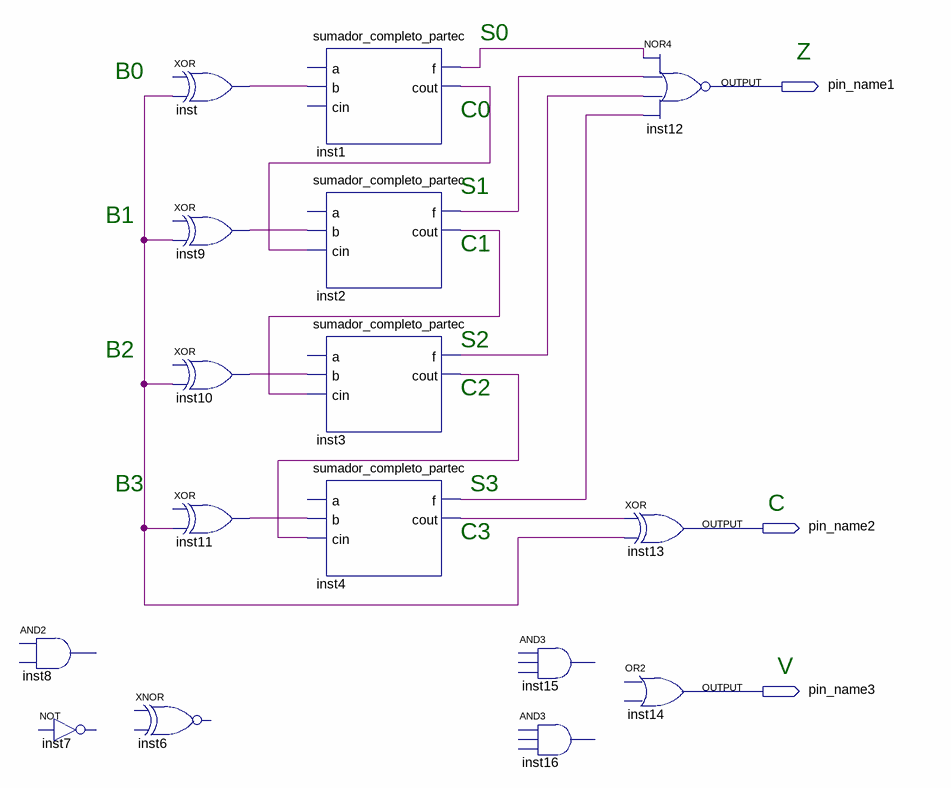
[diagram p0: schematic sheet]
// Quartus schematic sumador_completo_partec.bdf as structural Verilog: 16 symbols, 3 pins
module sumador_completo_partec (
  output pin_name1,
  output pin_name2,
  output pin_name3
);

  wire inst1_cout, inst1_f, inst2_cout, inst2_f, inst3_cout, inst3_f, inst4_cout, inst4_f, inst9_out,
       inst10_out, inst11_out, inst_out, undriven;

  // AND2 inst8 is placed but not wired
  // NOT inst7 is placed but not wired
  buf inst (inst_out, undriven);  // XOR open: IN1
  buf inst9 (inst9_out, undriven);  // XOR open: IN1
  buf inst10 (inst10_out, undriven);  // XOR open: IN1
  buf inst11 (inst11_out, undriven);  // XOR open: IN1
  // XNOR inst6 is placed but not wired
  sumador_completo_partec inst1 (.b(inst_out), .f(inst1_f), .cout(inst1_cout));  // open: a, cin
  sumador_completo_partec inst2 (.b(inst9_out), .cin(inst1_cout), .f(inst2_f), .cout(inst2_cout));  // open: a
  sumador_completo_partec inst3 (.b(inst10_out), .cin(inst2_cout), .f(inst3_f), .cout(inst3_cout));  // open: a
  sumador_completo_partec inst4 (.b(inst11_out), .cin(inst3_cout), .f(inst4_f), .cout(inst4_cout));  // open: a
  // AND3 inst15 is placed but not wired
  // AND3 inst16 is placed but not wired
  nor inst12 (pin_name1, inst1_f, inst2_f, inst3_f, inst4_f);
  xor inst13 (pin_name2, inst4_cout, undriven);
  // OR2 inst14 has open pins: IN1=open, IN2=open, OUT=pin_name3

  // Notes on the sheet:
  //   S0
  //   Z
  //   B0
  //   C0
  //   S1
  //   B1
  //   C1
  //   S2
  //   B2
  //   C2
  //   B3
  //   S3
  //   C
  //   C3
  //   V
endmodule
